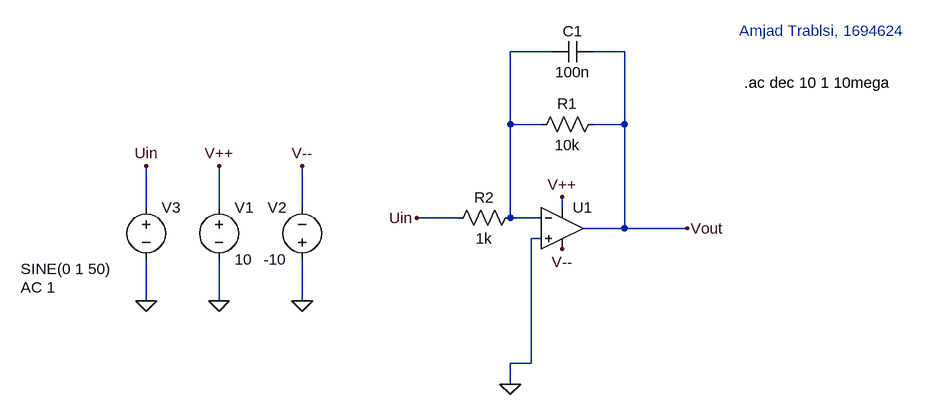
[diagram p0: schematic 4_1_1.asc]
4_1_1.asc, the LTspice schematic file:
Version 4
SHEET 1 968 680
WIRE 416 -80 352 -80
WIRE 528 -80 480 -80
WIRE 352 32 352 -80
WIRE 400 32 352 32
WIRE 528 32 528 -80
WIRE 528 32 480 32
WIRE -208 160 -208 96
WIRE -96 160 -96 96
WIRE 32 160 32 96
WIRE 432 160 432 144
WIRE 272 176 208 176
WIRE 352 176 352 32
WIRE 400 176 352 176
WIRE 528 192 528 32
WIRE 528 192 464 192
WIRE 624 192 528 192
WIRE 400 208 384 208
WIRE -208 304 -208 240
WIRE -96 304 -96 240
WIRE 32 304 32 240
WIRE 384 400 384 208
WIRE 384 400 352 400
WIRE 352 432 352 400
FLAG 352 432 0
FLAG -96 304 0
FLAG -96 96 V++
FLAG 432 144 V++
FLAG 32 304 0
FLAG 32 96 V--
FLAG 432 224 V--
FLAG 624 192 Vout
FLAG -208 304 0
FLAG -208 96 Uin
FLAG 208 176 Uin
SYMBOL cap 480 -96 R90
WINDOW 0 0 32 VBottom 2
WINDOW 3 32 32 VTop 2
SYMATTR InstName C1
SYMATTR Value 100n
SYMBOL res 496 16 R90
WINDOW 0 0 56 VBottom 2
WINDOW 3 32 56 VTop 2
SYMATTR InstName R1
SYMATTR Value 10k
SYMBOL voltage -96 144 R0
WINDOW 123 0 0 Left 0
WINDOW 39 0 0 Left 0
SYMATTR InstName V1
SYMATTR Value 10
SYMBOL voltage 32 256 R180
WINDOW 0 24 96 Left 2
WINDOW 3 24 16 Left 2
WINDOW 123 0 0 Left 0
WINDOW 39 0 0 Left 0
SYMATTR InstName V2
SYMATTR Value -10
SYMBOL voltage -208 144 R0
WINDOW 3 -193 111 Left 2
WINDOW 123 -193 139 Left 2
WINDOW 39 0 0 Left 0
SYMATTR Value SINE(0 1 50)
SYMATTR Value2 AC 1
SYMATTR InstName V3
SYMBOL res 368 160 R90
WINDOW 0 0 56 VBottom 2
WINDOW 3 32 56 VTop 2
SYMATTR InstName R2
SYMATTR Value 1k
SYMBOL OpAmps/UniversalOpAmp 432 192 R0
SYMATTR InstName U1
TEXT 712 -32 Left 2 !.ac dec 10 1 10mega
TEXT 704 -112 Left 2 ;Amjad Trablsi, 1694624

The netlist it stands for:
* 4_1_1.asc
C1 Vout N001 100n
R1 Vout N001 10k
V1 V++ 0 10
V2 0 V-- -10
V3 Uin 0 SINE(0 1 50) AC 1
R2 N001 Uin 1k
XU1 0 N001 V++ V-- Vout level1 Avol=1Meg GBW=10Meg Vos=0 En=0 Enk=0 In=0 Ink=0 Rin=500Meg  ; pins In+ In- V+ V- OUT
.ac dec 10 1 10mega
* Amjad Trablsi, 1694624
.lib UniversalOpAmp1.lib
.backanno
.end